# Altium schematic sheet 心率血氧检测仪2.SchDoc
size A4
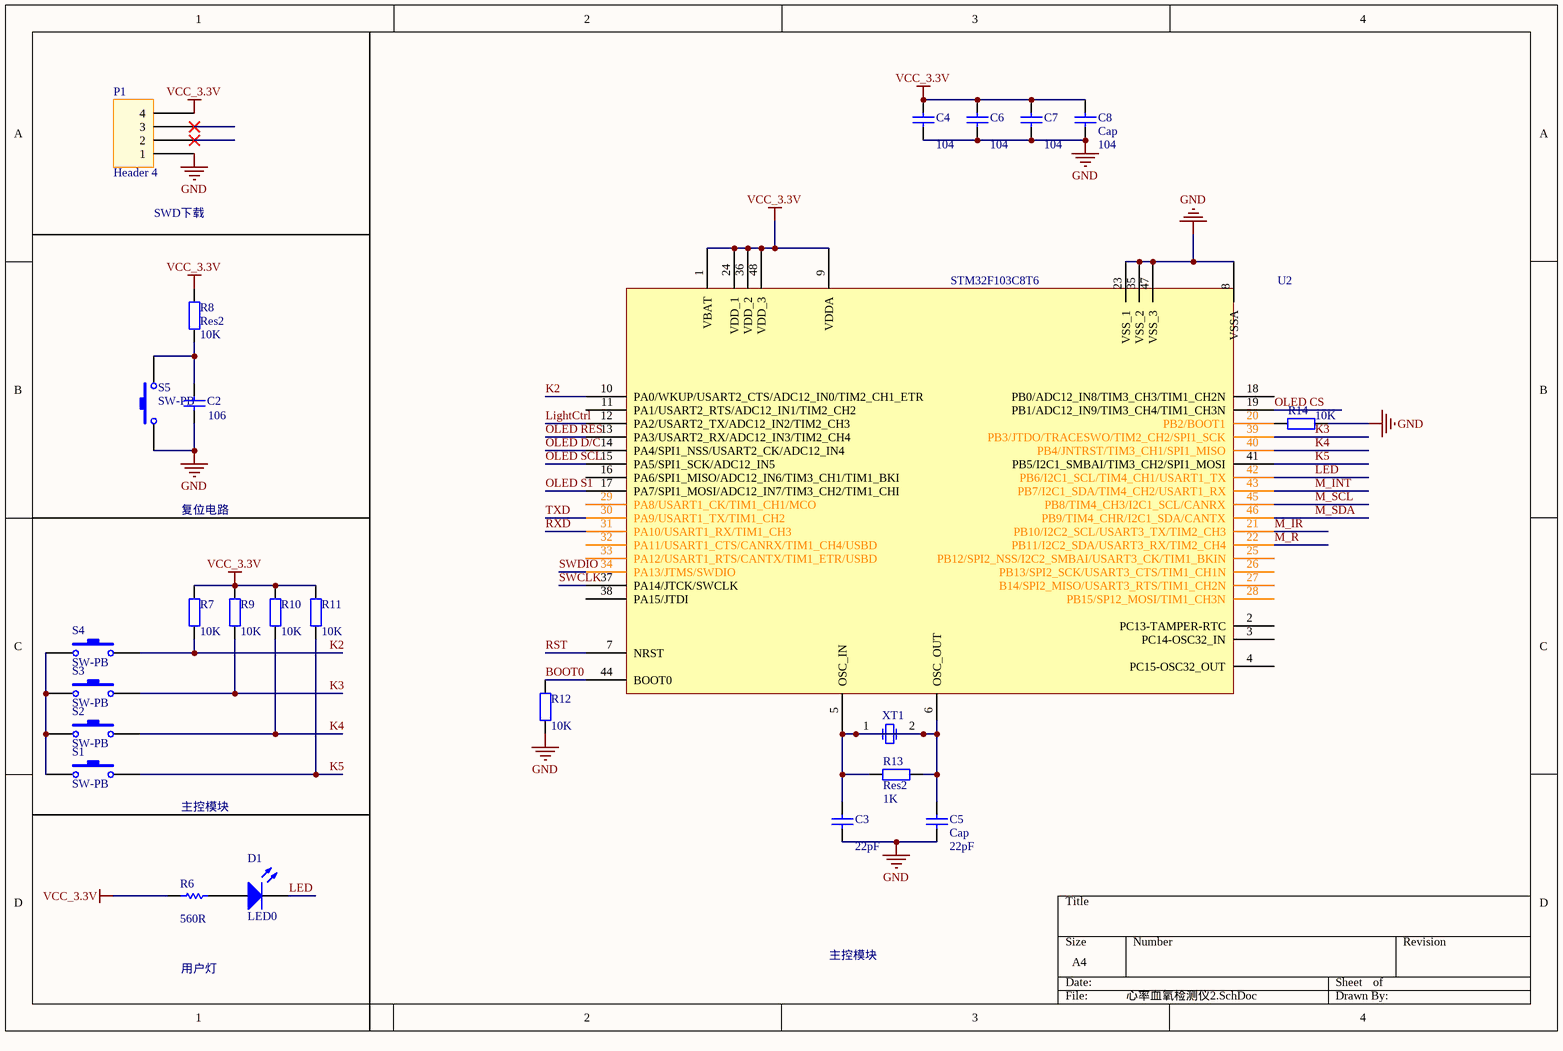
[diagram p0: 心率血氧检测仪2.SchDoc]

## Parts
C2  value 106  [0805C]  (hidden comment: Cap)
C3  value 22pF  [0805C]  (hidden comment: Cap)
C4  value 104  [0805C]  (hidden comment: Cap)
C5  Cap  value 22pF  [0805C]
C6  value 104  [0805C]  (hidden comment: Cap)
C7  value 104  [0805C]  (hidden comment: Cap)
C8  Cap  value 104  [0805C]
D1  LED0  [LED_0805]
P1  Header 4  [HDR1X4]
R6  value 560R  [电阻0805]  (hidden comment: Res Semi)
R7  value 10K  [0805]  (hidden comment: Res2)
R8  Res2  value 10K  [0805]
R9  value 10K  [0805]  (hidden comment: Res2)
R10  value 10K  [0805]  (hidden comment: Res2)
R11  value 10K  [0805]  (hidden comment: Res2)
R12  value 10K  [0805]  (hidden comment: Res2)
R13  Res2  value 1K  [0805]
R14  value 10K  [0805]  (hidden comment: Res2)
S1  SW-PB  [2脚按键]
S2  SW-PB  [2脚按键]
S3  SW-PB  [2脚按键]
S4  SW-PB  [2脚按键]
S5  SW-PB  [2脚按键]
U2  STM32F103C8T6  [LQFP48]
XT1  XTAL  [HC-49S]  (value not drawn)

## Nets
GND: C2.1 C3.1 C4.1 C5.1 C6.1 C7.1 C8.1 P1.1 R12.1 R14.2 S5.1 U2.8(VSSA) U2.23(VSS_1) U2.35(VSS_2) U2.47(VSS_3)
VCC_3.3V: C4.2 C6.2 C7.2 C8.2 P1.4 R6.1 R7.2 R8.2 R9.2 R10.2 R11.2 U2.1(VBAT) U2.9(VDDA) U2.24(VDD_1) U2.36(VDD_2) U2.48(VDD_3)
BOOT0: R12.2 U2.44(BOOT0)
K2: R7.1 S4.2 U2.10(PA0/WKUP/USART2_CTS/ADC12_IN0/TIM2_CH1_ETR)
K3: R9.1 S3.2 U2.39(PB3/JTDO/TRACESWO/TIM2_CH2/SPI1_SCK)
K4: R10.1 S2.2 U2.40(PB4/JNTRST/TIM3_CH1/SPI1_MISO)
K5: R11.1 S1.2 U2.41(PB5/I2C1_SMBAI/TIM3_CH2/SPI1_MOSI)
LED: D1.2(K) U2.42(PB6/I2C1_SCL/TIM4_CH1/USART1_TX)
LightCtrl: U2.12(PA2/USART2_TX/ADC12_IN2/TIM2_CH3)
M_INT: U2.43(PB7/I2C1_SDA/TIM4_CH2/USART1_RX)
M_IR: U2.21(PB10/I2C2_SCL/USART3_TX/TIM2_CH3)
M_R: U2.22(PB11/I2C2_SDA/USART3_RX/TIM2_CH4)
M_SCL: U2.45(PB8/TIM4_CH3/I2C1_SCL/CANRX)
M_SDA: U2.46(PB9/TIM4_CHR/I2C1_SDA/CANTX)
OLED CS: U2.19(PB1/ADC12_IN9/TIM3_CH4/TIM1_CH3N)
OLED D/C: U2.14(PA4/SPI1_NSS/USART2_CK/ADC12_IN4)
OLED RES: U2.13(PA3/USART2_RX/ADC12_IN3/TIM2_CH4)
OLED S1: U2.17(PA7/SPI1_MOSI/ADC12_IN7/TIM3_CH2/TIM1_CHI)
OLED SCL: U2.15(PA5/SPI1_SCK/ADC12_IN5)
RST: U2.7(NRST)
RXD: U2.31(PA10/USART1_RX/TIM1_CH3)
SWCLK: U2.37(PA14/JTCK/SWCLK)
SWDIO: U2.34(PA13/JTMS/SWDIO)
TXD: U2.30(PA9/USART1_TX/TIM1_CH2)
NetC2_2: C2.2 R8.1 S5.2
NetC3_2: C3.2 C5.2 R13.1 R13.2 U2.5(OSC_IN) U2.6(OSC_OUT) XT1.1(OSC1) XT1.2(OSC2)
NetD1_1: D1.1(A) R6.2
NetR14_1: R14.1 U2.20(PB2/BOOT1)
NetS1_1: S1.1 S2.1 S3.1 S4.1

Not connected (* = marked no-connect by the designer): P1 2* 3*; U2 2(PC13-TAMPER-RTC) 3(PC14-OSC32_IN) 4(PC15-OSC32_OUT) 11(PA1/USART2_RTS/ADC12_IN1/TIM2_CH2) 16(PA6/SPI1_MISO/ADC12_IN6/TIM3_CH1/TIM1_BKI) 18(PB0/ADC12_IN8/TIM3_CH3/TIM1_CH2N) 25(PB12/SPI2_NSS/I2C2_SMBAI/USART3_CK/TIM1_BKIN) 26(PB13/SPI2_SCK/USART3_CTS/TIM1_CH1N) 27(B14/SPI2_MISO/USART3_RTS/TIM1_CH2N) 28(PB15/SP12_MOSI/TIM1_CH3N) 29(PA8/USART1_CK/TIM1_CH1/MCO) 32(PA11/USART1_CTS/CANRX/TIM1_CH4/USBD) 33(PA12/USART1_RTS/CANTX/TIM1_ETR/USBD) 38(PA15/JTDI)

## Notes on the sheet
- SWD下载
- 复位电路
- 主控模块
- 用户灯

## Library data of the parts
C2-C8 = Cap: Capacitor; Published: 8-Jun-2000; LatestRevisionDate: 17-Jul-2002; LatestRevisionNote: Re-released for DXP Platform.; PackageReference: RAD-0.3; Publisher: Altium Limited; PackageDescription: Radial Cap, Thru-Hole; 2 Leads; 0.3 in Pin Spacing
D1 = LED0: Typical INFRARED GaAs LED; Published: 8-Jun-2000; LatestRevisionDate: 08-Jul-2005; LatestRevisionNote: Mech Layer 1 removed.; PackageReference: LED-0; Publisher: Altium Limited; PackageDescription: LED; 2 Leads
R6 = Res Semi: Semiconductor Resistor; Published: 8-Jun-2000; LatestRevisionDate: 17-Jul-2002; LatestRevisionNote: Re-released for DXP Platform.; PackageReference: AXIAL-0.5; Publisher: Altium Limited; PackageDescription: Axial Device, Thru-Hole; 2 Leads; 0.5 in Pin Spacing
R7-R14 = Res2: Resistor; Published: 8-Jun-2000; LatestRevisionDate: 17-Jul-2002; LatestRevisionNote: Re-released for DXP Platform.; PackageReference: AXIAL-0.4; Publisher: Altium Limited; PackageDescription: Axial Device, Thru-Hole; 2 Leads; 0.4 in Pin Spacing
S1-S5 = SW-PB: Switch; Published: 24-Mar-1999; LatestRevisionDate: 17-Jul-2002; LatestRevisionNote: Re-released for DXP Platform.; PackageReference: SPST-2; Publisher: Altium Limited; PackageDescription: Switch; 2 Leads
XT1 = XTAL: Crystal Oscillator; Published: 8-Jun-2000; LatestRevisionDate: 17-Jul-2002; LatestRevisionNote: Re-released for DXP Platform.; PackageReference: R38; Publisher: Altium Limited; PackageDescription: Crystal, Thru-Hole; 2 Leads; Body 3.1 x 8.2 mm (Dia.xH)